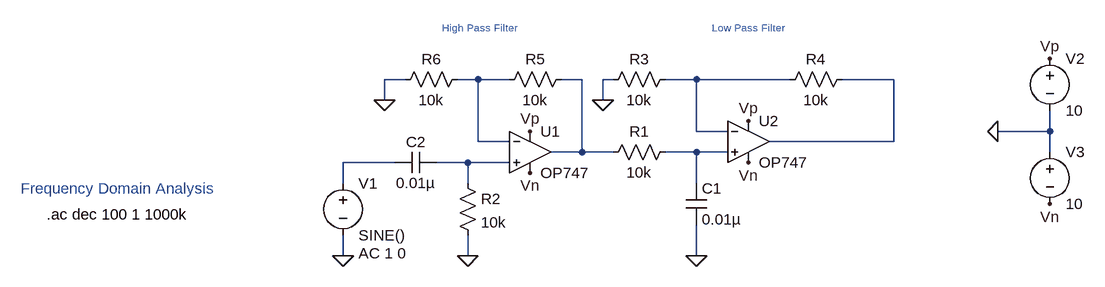
[diagram p0: schematic band_pass_filter.asc]
band_pass_filter.asc, the LTspice schematic file:
Version 4
SHEET 1 984 680
WIRE -80 48 -112 48
WIRE 32 48 0 48
WIRE 80 48 32 48
WIRE 192 48 160 48
WIRE 240 48 224 48
WIRE 368 48 320 48
WIRE 512 48 368 48
WIRE 672 48 592 48
WIRE -112 80 -112 48
WIRE 224 80 224 48
WIRE 368 128 368 48
WIRE 416 128 368 128
WIRE 912 128 912 96
WIRE 912 128 832 128
WIRE 32 144 32 48
WIRE 80 144 32 144
WIRE 672 144 672 48
WIRE 672 144 480 144
WIRE 192 160 192 48
WIRE 192 160 144 160
WIRE 240 160 192 160
WIRE 368 160 320 160
WIRE 416 160 368 160
WIRE 912 160 912 128
WIRE -96 176 -176 176
WIRE 16 176 -32 176
WIRE 80 176 16 176
WIRE -176 208 -176 176
WIRE 16 208 16 176
WIRE 368 208 368 160
WIRE -176 320 -176 288
WIRE 16 320 16 288
WIRE 368 320 368 272
FLAG -112 80 0
FLAG 16 320 0
FLAG 368 320 0
FLAG -176 320 0
FLAG 832 128 0
FLAG 224 80 0
FLAG 912 16 Vp
FLAG 448 112 Vp
FLAG 112 128 Vp
FLAG 912 240 Vn
FLAG 448 176 Vn
FLAG 112 192 Vn
SYMBOL OpAmps\\OP747 112 96 R0
SYMATTR InstName U1
SYMBOL OpAmps\\OP747 448 80 R0
SYMATTR InstName U2
SYMBOL res 336 144 R90
WINDOW 0 0 56 VBottom 2
WINDOW 3 32 56 VTop 2
SYMATTR InstName R1
SYMATTR Value 10k
SYMBOL res 0 192 R0
SYMATTR InstName R2
SYMATTR Value 10k
SYMBOL res 336 32 R90
WINDOW 0 0 56 VBottom 2
WINDOW 3 32 56 VTop 2
SYMATTR InstName R3
SYMATTR Value 10k
SYMBOL res 608 32 R90
WINDOW 0 0 56 VBottom 2
WINDOW 3 32 56 VTop 2
SYMATTR InstName R4
SYMATTR Value 10k
SYMBOL res 176 32 R90
WINDOW 0 0 56 VBottom 2
WINDOW 3 32 56 VTop 2
SYMATTR InstName R5
SYMATTR Value 10k
SYMBOL res 16 32 R90
WINDOW 0 0 56 VBottom 2
WINDOW 3 32 56 VTop 2
SYMATTR InstName R6
SYMATTR Value 10k
SYMBOL cap 352 208 R0
SYMATTR InstName C1
SYMATTR Value 0.01µ
SYMBOL cap -32 160 R90
WINDOW 0 0 32 VBottom 2
WINDOW 3 32 32 VTop 2
SYMATTR InstName C2
SYMATTR Value 0.01µ
SYMBOL voltage -176 192 R0
WINDOW 123 24 124 Left 2
WINDOW 39 0 0 Left 0
SYMATTR InstName V1
SYMATTR Value SINE()
SYMATTR Value2 AC 1 0
SYMBOL voltage 912 0 R0
WINDOW 123 0 0 Left 0
WINDOW 39 0 0 Left 0
SYMATTR InstName V2
SYMATTR Value 10
SYMBOL voltage 912 144 R0
WINDOW 123 0 0 Left 0
WINDOW 39 0 0 Left 0
SYMATTR InstName V3
SYMATTR Value 10
TEXT -632 256 Left 2 !.ac dec 100 1 1000k
TEXT -24 -32 Left 1 ;High Pass Filter
TEXT 392 -32 Left 1 ;Low Pass Filter
TEXT -672 216 Left 2 ;Frequency Domain Analysis

The netlist it stands for:
* band_pass_filter.asc
XU1 N007 N001 Vp Vn N002 OP747  ; pins In+ In- V+ V- OUT
XU2 N005 N003 Vp Vn N004 OP747  ; pins In+ In- V+ V- OUT
R1 N005 N002 10k
R2 N007 0 10k
R3 N003 0 10k
R4 N004 N003 10k
R5 N002 N001 10k
R6 N001 0 10k
C1 N005 0 0.01µ
C2 N007 N006 0.01µ
V1 N006 0 SINE() AC 1 0
V2 Vp 0 10
V3 0 Vn 10
.ac dec 100 1 1000k
* High Pass Filter
* Low Pass Filter
* Frequency Domain Analysis
.backanno
.end